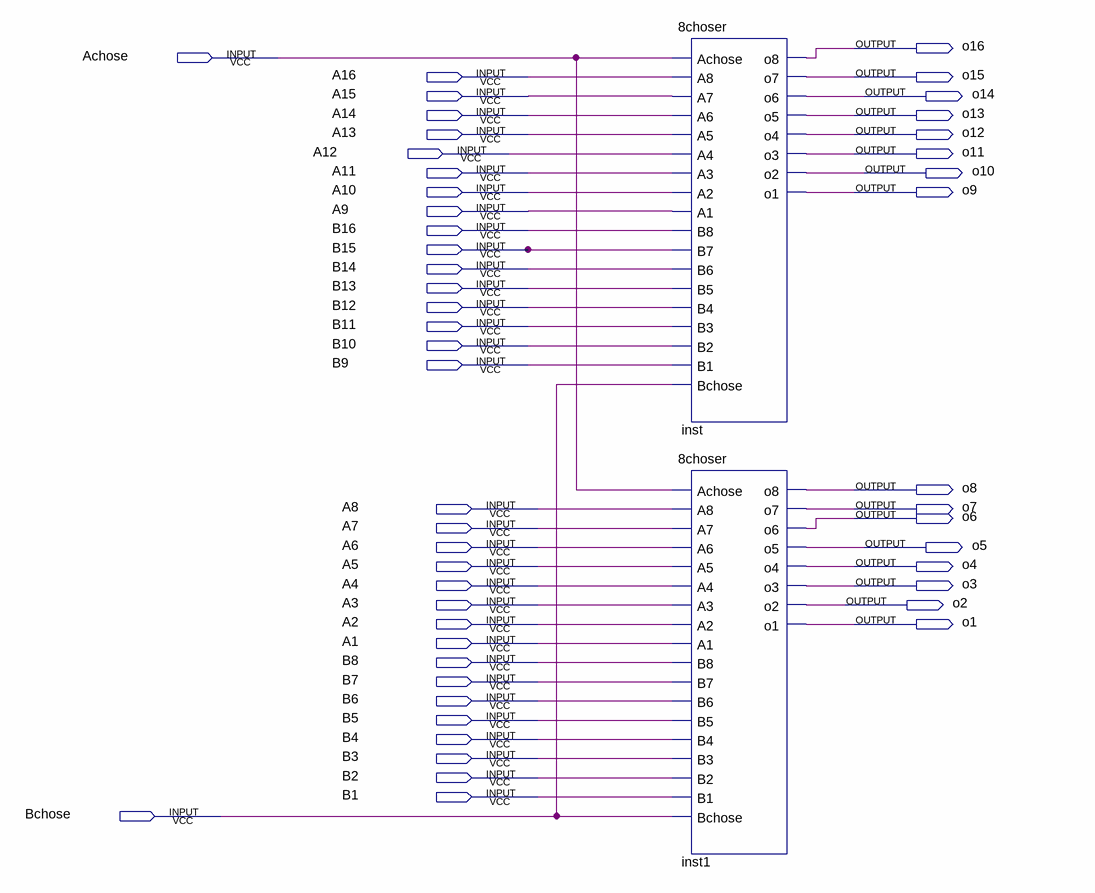
[diagram p0: schematic sheet]
// Quartus schematic 16choser.bdf as structural Verilog: 2 symbols, 50 pins
module \16choser  (
  input  Achose,
  input  A16,
  input  A15,
  input  A14,
  input  A13,
  input  A12,
  input  A11,
  input  A10,
  input  A9,
  input  B16,
  input  B15,
  input  B14,
  input  B13,
  input  B12,
  input  B11,
  input  B10,
  input  B9,
  input  A8,
  input  A7,
  input  A6,
  input  A5,
  input  A4,
  input  A3,
  input  A2,
  input  A1,
  input  B8,
  input  B7,
  input  B6,
  input  B5,
  input  B4,
  input  B3,
  input  B2,
  input  B1,
  input  Bchose,
  output o16,
  output o15,
  output o14,
  output o13,
  output o12,
  output o11,
  output o10,
  output o9,
  output o8,
  output o7,
  output o6,
  output o5,
  output o4,
  output o3,
  output o2,
  output o1
);

  \8choser  inst (
    .Achose(Achose), .A8(A16), .A7(A15), .A6(A14), .A5(A13), .A4(A12), .A3(A11), .A2(A10), .A1(A9), .B8(B16),
    .B7(B15), .B6(B14), .B5(B13), .B4(B12), .B3(B11), .B2(B10), .B1(B9), .Bchose(Bchose), .o8(o16), .o7(o15),
    .o6(o14), .o5(o13), .o4(o12), .o3(o11), .o2(o10), .o1(o9));
  \8choser  inst1 (
    .Achose(Achose), .A8(A8), .A7(A7), .A6(A6), .A5(A5), .A4(A4), .A3(A3), .A2(A2), .A1(A1), .B8(B8),
    .B7(B7), .B6(B6), .B5(B5), .B4(B4), .B3(B3), .B2(B2), .B1(B1), .Bchose(Bchose), .o8(o8), .o7(o7),
    .o6(o6), .o5(o5), .o4(o4), .o3(o3), .o2(o2), .o1(o1));
endmodule
